# Altium schematic sheet Gas_Sensor.SchDoc: Gas Sensor Main Schematic
size A4; DrawnBy: Flávio Silva; Engineer: Flávio Silva; Organization: CeNTI; Address1: Rua Fernando Mesquita 2785; Address2: Vila Nova de Famalicão; Address3: 4760-034, Portugal; Revision: 0; SheetNumber: 1; SheetTotal: 3; Project: AM2R- Safe2Wheels
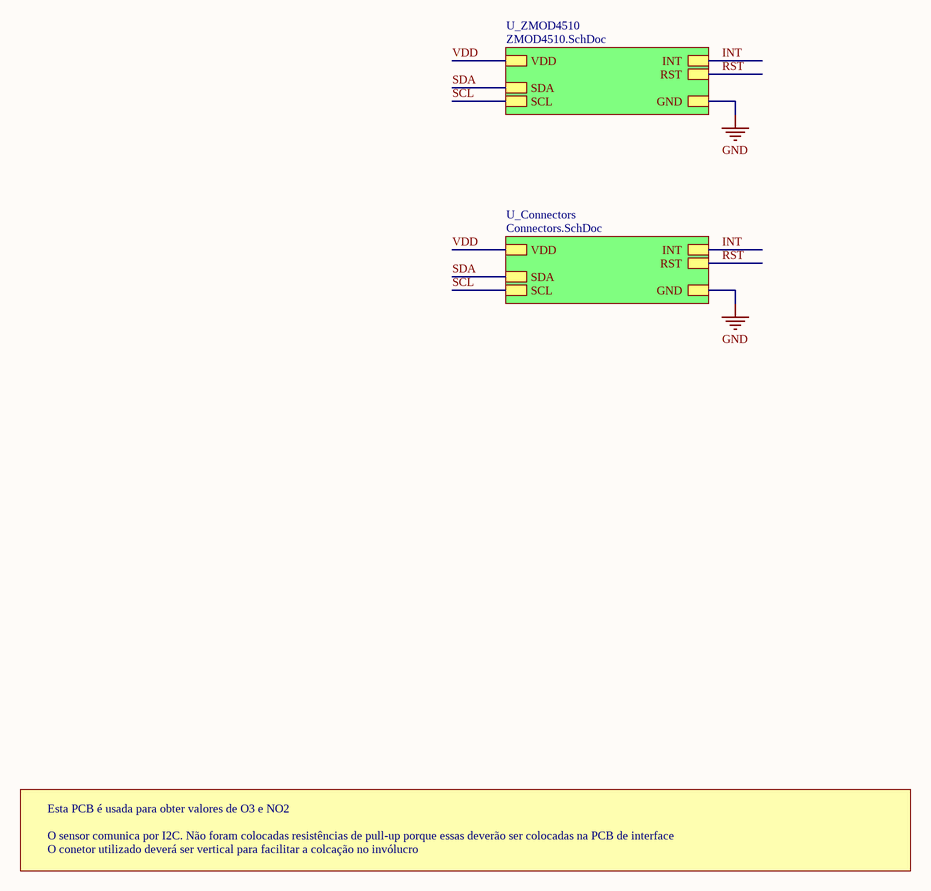
[diagram p0: Gas_Sensor.SchDoc]

## Sub-sheets
U_Connectors = Connectors.SchDoc: VDD, SCL, SDA, INT, GND, RST
U_ZMOD4510 = ZMOD4510.SchDoc: VDD, SCL, SDA, INT, GND, RST

## Nets
GND: sheet U_Connectors/GND, sheet U_ZMOD4510/GND
INT: sheet U_Connectors/INT, sheet U_ZMOD4510/INT
RST: sheet U_Connectors/RST, sheet U_ZMOD4510/RST
SCL: sheet U_Connectors/SCL, sheet U_ZMOD4510/SCL
SDA: sheet U_Connectors/SDA, sheet U_ZMOD4510/SDA
VDD: sheet U_Connectors/VDD, sheet U_ZMOD4510/VDD

## Notes on the sheet
- Esta PCB é usada para obter valores de O3 e NO2
- O sensor comunica por I2C. Não foram colocadas resistências de pull-up porque essas deverão ser colocadas na PCB de interface
- O conetor utilizado deverá ser vertical para facilitar a colcação no invólucro
- Title:
- Project:
- Date:
- Rev:
- Sheet
- of
- Author: